# EAGLE design oresat-backplane-breakout (EAGLE 7.5.0)
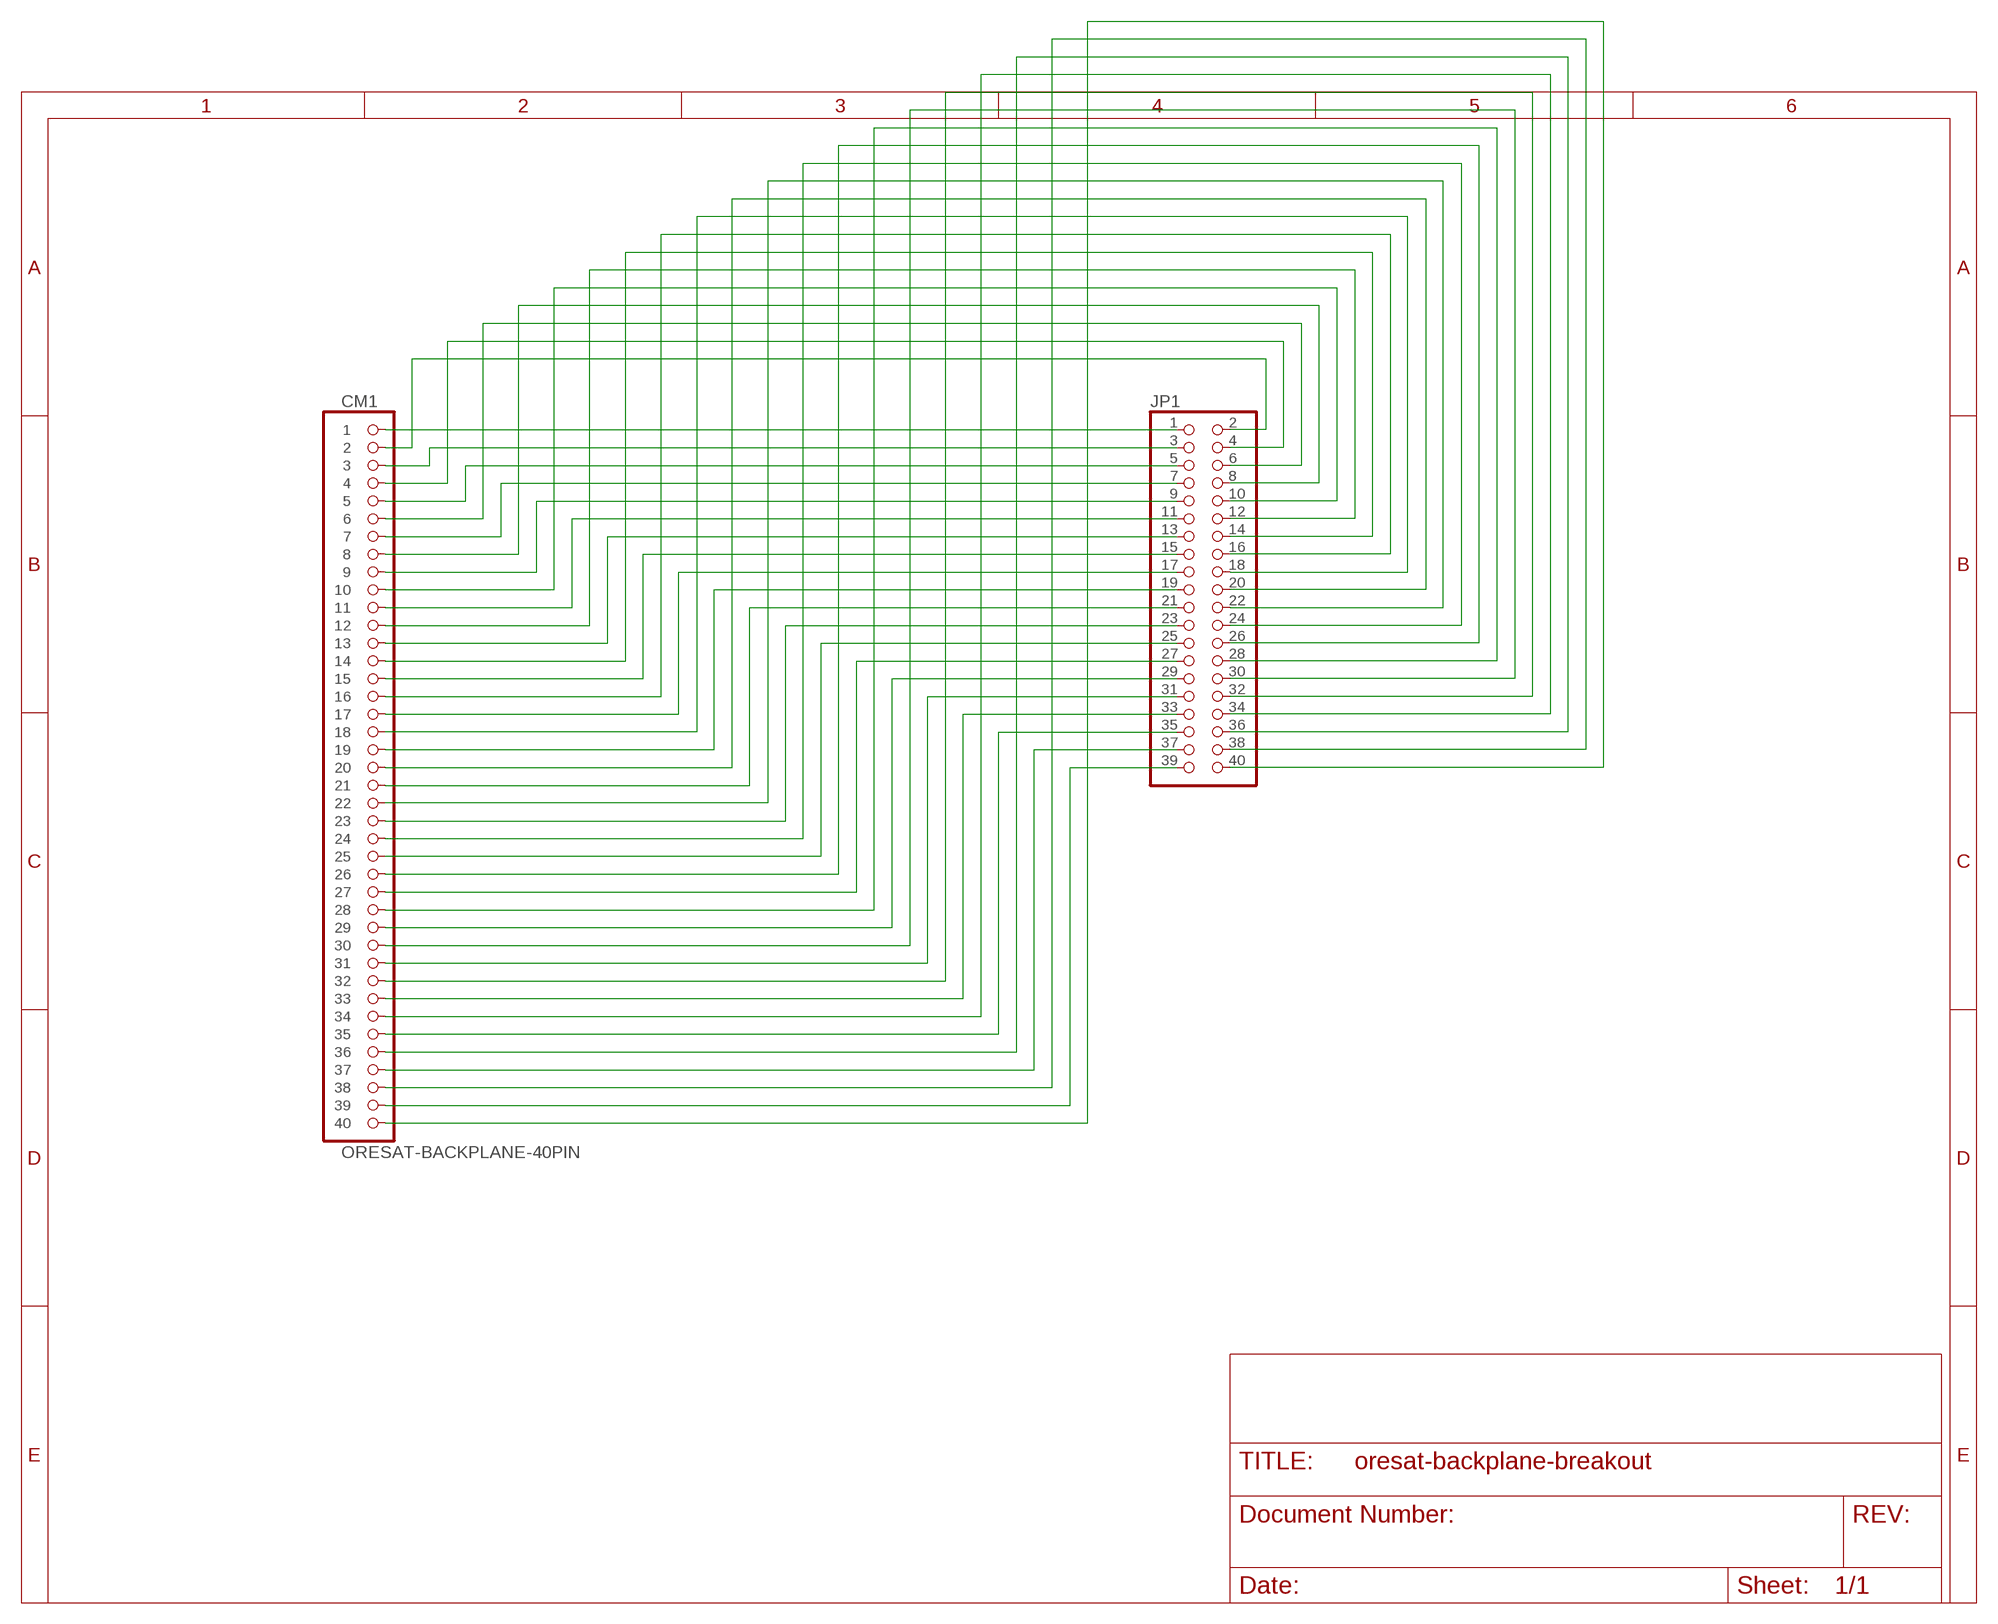
[diagram p0: schematic, sheet 1]

## Parts
CM1  ORESAT-BACKPLANE-40PIN  [HARWIN-ARCHER-M50-3502042]
JP1  PINHD-2X20  [2X20]

## Nets
1: CM1.P$1 JP1.1
2: CM1.P$2 JP1.2
3: CM1.P$3 JP1.3
4: CM1.P$4 JP1.4
5: CM1.P$5 JP1.5
6: CM1.P$6 JP1.6
7: CM1.P$7 JP1.7
8: CM1.P$8 JP1.8
9: CM1.P$9 JP1.9
10: CM1.P$10 JP1.10
N$11: CM1.P$11 JP1.11
N$12: CM1.P$12 JP1.12
N$13: CM1.P$14 JP1.14
N$14: CM1.P$13 JP1.13
N$15: CM1.P$15 JP1.15
N$16: CM1.P$17 JP1.17
N$17: CM1.P$19 JP1.19
N$18: CM1.P$21 JP1.21
N$19: CM1.P$23 JP1.23
N$20: CM1.P$25 JP1.25
N$21: CM1.P$27 JP1.27
N$22: CM1.P$29 JP1.29
N$23: CM1.P$31 JP1.31
N$24: CM1.P$33 JP1.33
N$25: CM1.P$35 JP1.35
N$26: CM1.P$37 JP1.37
N$27: CM1.P$39 JP1.39
N$28: CM1.P$16 JP1.16
N$29: CM1.P$18 JP1.18
N$30: CM1.P$20 JP1.20
N$31: CM1.P$22 JP1.22
N$32: CM1.P$24 JP1.24
N$33: CM1.P$26 JP1.26
N$34: CM1.P$28 JP1.28
N$35: CM1.P$30 JP1.30
N$36: CM1.P$32 JP1.32
N$37: CM1.P$34 JP1.34
N$38: CM1.P$36 JP1.36
N$39: CM1.P$38 JP1.38
N$40: CM1.P$40 JP1.40

## Library data of the parts
CM1 = oresat-eagle:ORESAT-BACKPLANE-40PIN
JP1 = pinhead:PINHD-2X20: PIN HEADER

## Board
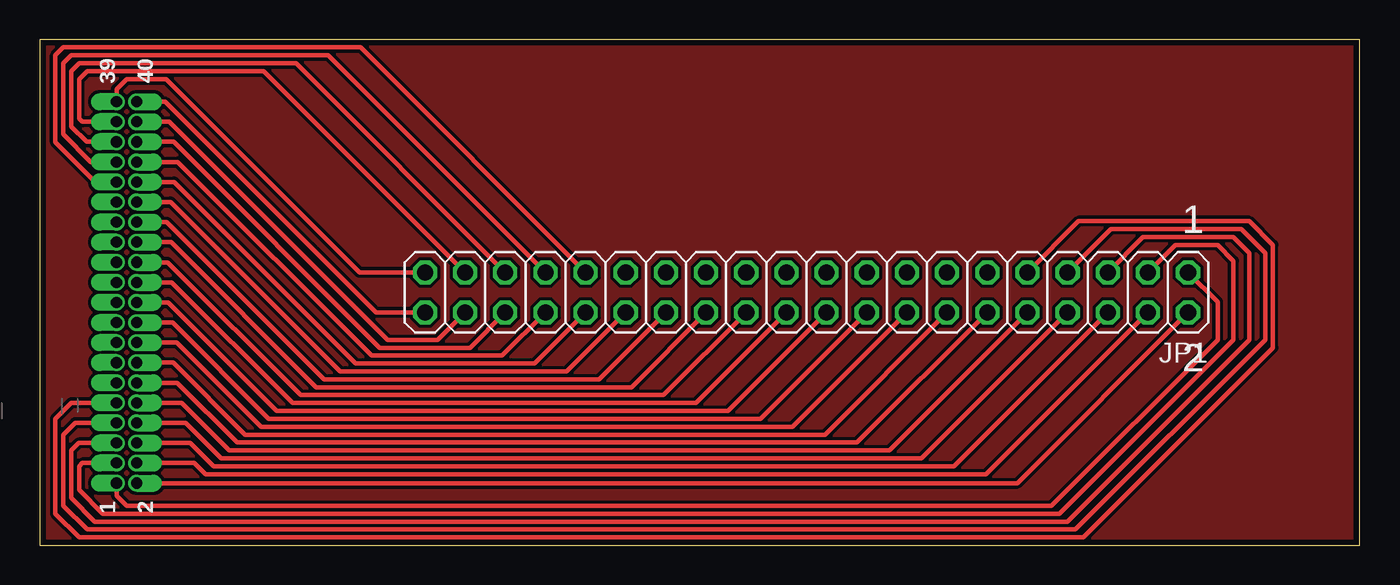
[diagram p1: board, top side]
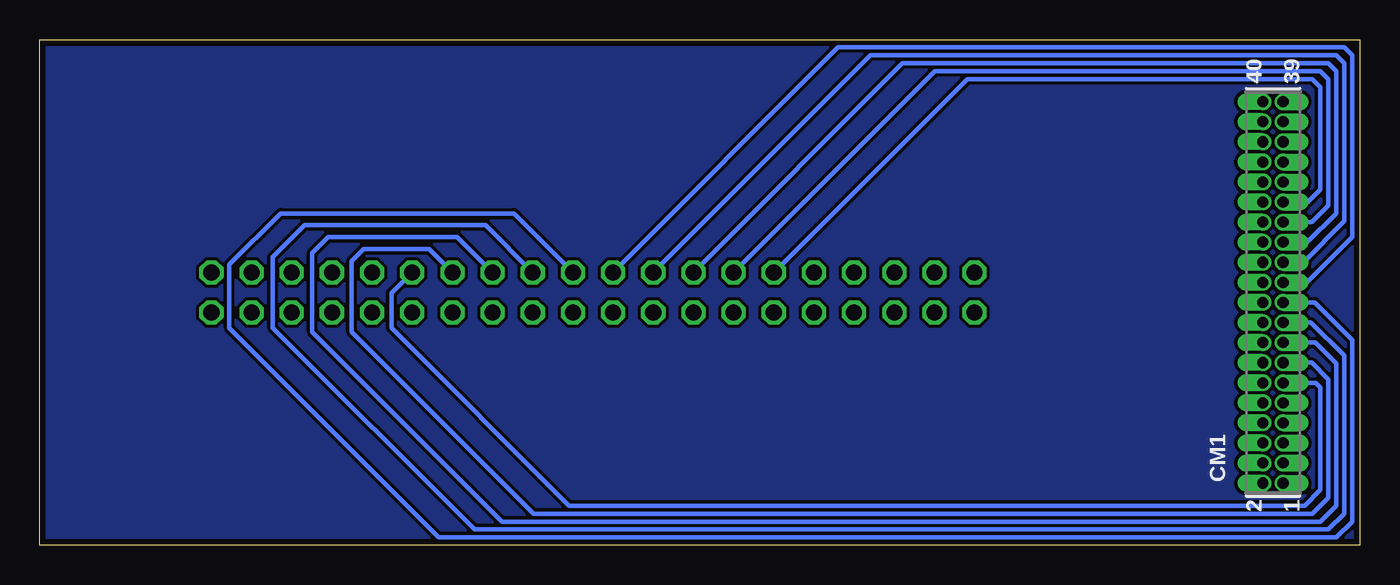
[diagram p2: board, bottom side, seen from below]

Size 83.5 x 32 mm. Coordinates in mm from the lower left corner, seen from the top.
Outline: 0,0 83.5,0 83.5,32 0,32 0,0
Copper layers (1*2*15*16): Top 0.035559375mm / dielectric 0.17018125mm / Route2 0.01778125mm / dielectric 47mil / Route15 0.01778125mm / dielectric 0.17018125mm / Bottom 0.035559375mm
Design rules "oshpark_4lyr": minimum track width 5mil, minimum drill 10mil, track to track 5mil, track to pad 5mil, pad to pad 5mil, via to via 5mil, smd to smd 5mil, copper to edge 15mil, drill to drill 6mil, minimum pad ring 4mil, minimum via ring 4mil, stop-mask expansion 4mil, vias tented up to drill 0mil, thermal gap 10mil
tKeepout: area 0,5 to 5,10; area 78,5 to 83,10; area 0,25 to 5,30; area 78,25 to 83,30; area 0,45 to 5,50; area 78,45 to 83,50; area 0,65 to 5,70; area 78,65 to 83,70; area 0,85 to 5,90; area 78,85 to 83,90; area 0,124 to 5,129; area 78,124 to 83,129; 10 more areas

### Footprints (pad centres in the part's own frame; a part is rotated, then mirrored left to right if it is on the bottom)
HARWIN-ARCHER-M50-3502042 = drill 0.7 pad 1.07 offset: P$1 -12.065,-0.635; P$2 -12.065,0.635; P$3 -10.795,-0.635; P$4 -10.795,0.635; P$5 -9.525,-0.635; P$6 -9.525,0.635; P$7 -8.255,-0.635; P$8 -8.255,0.635; P$9 -6.985,-0.635; P$10 -6.985,0.635; P$11 -5.715,-0.635; P$12 -5.715,0.635; P$13 -4.445,-0.635; P$14 -4.445,0.635; P$15 -3.175,-0.635; P$16 -3.175,0.635; P$17 -1.905,-0.635; P$18 -1.905,0.635; P$19 -0.635,-0.635; P$20 -0.635,0.635; P$21 0.635,-0.635; P$22 0.635,0.635; P$23 1.905,-0.635; P$24 1.905,0.635; P$25 3.175,-0.635; P$26 3.175,0.635; P$27 4.445,-0.635; P$28 4.445,0.635; P$29 5.715,-0.635; P$30 5.715,0.635; P$31 6.985,-0.635; P$32 6.985,0.635; P$33 8.255,-0.635; P$34 8.255,0.635; P$35 9.525,-0.635; P$36 9.525,0.635; P$37 10.795,-0.635; P$38 10.795,0.635; P$39 12.065,-0.635; P$40 12.065,0.635
2X20 = drill 1.016 octagon: 1 -24.13,-1.27; 2 -24.13,1.27; 3 -21.59,-1.27; 4 -21.59,1.27; 5 -19.05,-1.27; 6 -19.05,1.27; 7 -16.51,-1.27; 8 -16.51,1.27; 9 -13.97,-1.27; 10 -13.97,1.27; 11 -11.43,-1.27; 12 -11.43,1.27; 13 -8.89,-1.27; 14 -8.89,1.27; 15 -6.35,-1.27; 16 -6.35,1.27; 17 -3.81,-1.27; 18 -3.81,1.27; 19 -1.27,-1.27; 20 -1.27,1.27; 21 1.27,-1.27; 22 1.27,1.27; 23 3.81,-1.27; 24 3.81,1.27; 25 6.35,-1.27; 26 6.35,1.27; 27 8.89,-1.27; 28 8.89,1.27; 29 11.43,-1.27; 30 11.43,1.27; 31 13.97,-1.27; 32 13.97,1.27; 33 16.51,-1.27; 34 16.51,1.27; 35 19.05,-1.27; 36 19.05,1.27; 37 21.59,-1.27; 38 21.59,1.27; 39 24.13,-1.27; 40 24.13,1.27

### Placement (x,y rotation side)
CM1  5.5,16 90 bottom
JP1  48.5,16 180 top

### Tracks (layer width: path | path; a pad name or v marks a point on that pad's centre or on a via)
1
  Top 0.3: CM1.P$1 4.87,3.13 5.5,2.5 64,2.5 74.5,13 74.5,15.4 JP1.1
2
  Top 0.3: CM1.P$2 61.84,3.94 JP1.2
3
  Top 0.3: CM1.P$3 2.71,5.21 2.5,5 2.5,3.5 4,2 64.5,2 75.5,13 75.5,18 74.5,19 71.82,19 JP1.3
4
  Top 0.3: CM1.P$4 9.79,5.21 10.5,4.5 59.86,4.5 JP1.4
5
  Top 0.3: CM1.P$5 2.48,6.47 2,6 2,3 3.5,1.5 65,1.5 76.5,13 76.5,18.5 75.5,19.5 69.78,19.5 JP1.5
6
  Top 0.3: CM1.P$6 9.53,6.47 11,5 57.82,5 JP1.6
7
  Top 0.3: CM1.P$7 2.25,7.75 1.5,7 1.5,2.5 3,1 65.5,1 77.5,13 77.5,18.5 76,20 67.74,20 JP1.7
8
  Top 0.3: CM1.P$8 9.26,7.75 11.5,5.5 55.78,5.5 JP1.8
9
  Top 0.3: CM1.P$9 2.02,9.02 1,8 1,2 2.5,0.5 66,0.5 78,12.5 78,19 76.5,20.5 65.7,20.5 JP1.9
10
  Top 0.3: CM1.P$10 8.98,9.02 12,6 53.74,6 JP1.10
GND
  pour Top (isolate 0.2, rank 6, no thermals): 0,0 0,32 83.5,32 83.5,0
  pour Bottom (isolate 0.2, rank 6): 0,0 0,32 83.5,32 83.5,0
N$11
  Bottom 0.3: CM1.P$11 2.79,10.29 2.5,10 2.5,3.5 3.5,2.5 50,2.5 61.25,13.75 61.25,15.95 JP1.11
N$12
  Top 0.3: CM1.P$12 8.71,10.29 12.5,6.5 51.7,6.5 JP1.12
N$13
  Top 0.3: CM1.P$14 8.45,11.55 13,7 49.66,7 JP1.14
N$14
  Bottom 0.3: CM1.P$13 3.06,11.55 2,10.5 2,3 3,2 52.25,2 63.75,13.5 63.75,18 63,18.75 58.87,18.75 JP1.13
N$15
  Bottom 0.3: CM1.P$15 2.83,12.82 1.5,11.5 1.5,2.5 2.5,1.5 54.25,1.5 66.25,13.5 66.25,18.5 65.25,19.5 57.08,19.5 JP1.15
N$16
  Bottom 0.3: CM1.P$17 3.1,14.1 1,12 1,2 2,1 56,1 68.75,13.75 68.75,18.25 66.75,20.25 55.29,20.25 JP1.17
N$17
  Bottom 0.3: CM1.P$19 2.87,15.37 0.5,13 0.5,1.5 1.5,0.5 58.25,0.5 71.5,13.75 71.5,17.75 68.25,21 53.5,21 JP1.19
N$18
  Bottom 0.3: CM1.P$21 3.37,16.64 0.5,19.5 0.5,31 1,31.5 33,31.5 JP1.21
N$19
  Bottom 0.3: CM1.P$23 3.6,17.91 1,20.5 1,30.5 1.5,31 30.96,31 JP1.23
N$20
  Bottom 0.3: CM1.P$25 3.33,19.18 1.5,21 1.5,30 2,30.5 28.92,30.5 JP1.25
N$21
  Bottom 0.3: CM1.P$27 3.06,20.45 2,21.5 2,29.5 2.5,30 26.88,30 JP1.27
N$22
  Bottom 0.3: CM1.P$29 3.29,21.71 2.5,22.5 2.5,29 3,29.5 24.84,29.5 JP1.29
N$23
  Top 0.3: CM1.P$31 3.52,22.98 1,25.5 1,31 1.5,31.5 20.3,31.5 JP1.31
N$24
  Top 0.3: CM1.P$33 3.25,24.25 1.5,26 1.5,30.5 2,31 18.26,31 JP1.33
N$25
  Top 0.3: CM1.P$35 2.98,25.52 2,26.5 2,30 2.5,30.5 16.22,30.5 JP1.35
N$26
  Top 0.3: CM1.P$37 2.71,26.8 2.5,27 2.5,29.5 3,30 14.18,30 JP1.37
N$27
  Top 0.3: CM1.P$39 4.87,28.86 5.5,29.5 8,29.5 20.23,17.27 JP1.39
N$28
  Top 0.3: CM1.P$16 8.68,12.82 14,7.5 47.62,7.5 JP1.16
N$29
  Top 0.3: CM1.P$18 8.4,14.1 14.5,8 45.58,8 JP1.18
N$30
  Top 0.3: CM1.P$20 8.13,15.37 15,8.5 43.54,8.5 JP1.20
N$31
  Top 0.3: CM1.P$22 8.37,16.64 16,9 41.5,9 JP1.22
N$32
  Top 0.3: CM1.P$24 8.1,17.91 16.5,9.5 39.46,9.5 JP1.24
N$33
  Top 0.3: CM1.P$26 8.32,19.18 17.5,10 37.42,10 JP1.26
N$34
  Top 0.3: CM1.P$28 8.05,20.45 18,10.5 35.38,10.5 JP1.28
N$35
  Top 0.3: CM1.P$30 8.29,21.71 19,11 33.34,11 JP1.30
N$36
  Top 0.3: CM1.P$32 8.52,22.98 20,11.5 31.3,11.5 JP1.32
N$37
  Top 0.3: CM1.P$34 8.74,24.25 21,12 29.26,12 JP1.34
N$38
  Top 0.3: CM1.P$36 8.47,25.52 21.5,12.5 27.22,12.5 JP1.36
N$39
  Top 0.3: CM1.P$38 8.21,26.8 22,13 25.18,13 JP1.38
N$40
  Top 0.3: CM1.P$40 7.93,28.07 21.27,14.73 JP1.40

### Text on the board
tPlace: 1 | 2